# EAGLE design m1k-minus-5-generator (EAGLE 7.7.0)
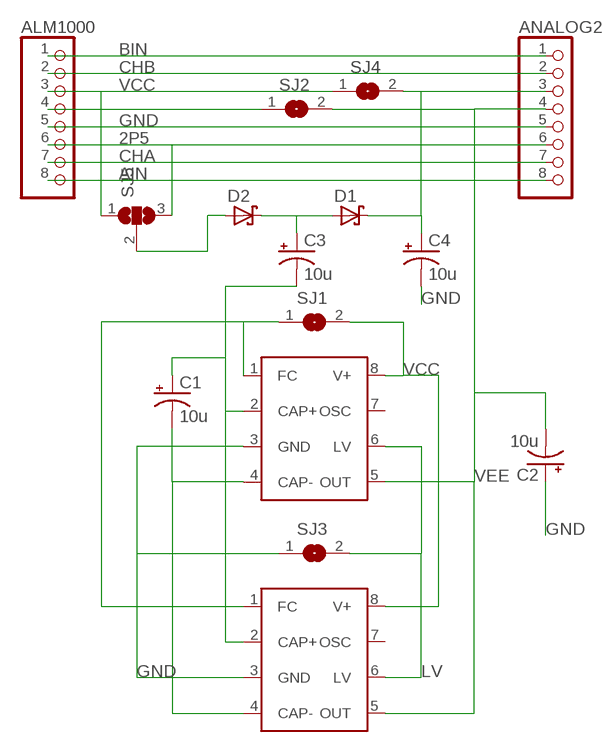
[diagram p0: schematic, sheet 1]

## Parts
ALM1000  PINHD-1X8  [1X08]
ANALOG2  PINHD-1X8  [1X08]
C1  10u  CPOL-USE2,5-6E  [E2,5-6E]
C2  10u  CPOL-USE2,5-6E  [E2,5-6E]
C3  10u  CPOL-USE2,5-6E  [E2,5-6E]
C4  10u  CPOL-USE2,5-6E  [E2,5-6E]
D1  SCHOTTKY-DIODEDO35-7  [DO35-7]
D2  SCHOTTKY-DIODEDO35-7  [DO35-7]
SJ1  SJ  [SJ]
SJ2  SJ  [SJ]
SJ3  SJ  [SJ]
SJ4  SJ  [SJ]
SJ5  SJ2W  [SJ_2]
U1  ADM660  [SO8]
U2  ADM660DIP  [DIL8]

## Nets
2P5: ALM1000.6 ANALOG2.6 SJ5.3
AIN: ALM1000.8 ANALOG2.8
BIN: ALM1000.1 ANALOG2.1
CHA: ALM1000.7 ANALOG2.7
CHB: ALM1000.2 ANALOG2.2
GND: ALM1000.5 ANALOG2.5 C2.+ C4.- SJ3.1 U1.3(GND) U2.3(GND)
LV: SJ3.2 U1.6(LV) U2.6(LV)
N$1: ALM1000.4 SJ2.1
N$2: ANALOG2.3 C4.+ D1.C SJ4.2
N$3: C3.+ D1.A D2.C
N$4: D2.A SJ5.2
N$7: C1.+ C3.- U1.2(CAP+) U2.2(CAP+)
N$10: C1.- U1.4(CAP-) U2.4(CAP-)
N$11: SJ1.1 U1.1(FC) U2.1(FC)
VCC: ALM1000.3 SJ1.2 SJ4.1 SJ5.1 U1.8(V+) U2.8(V+)
VEE: ANALOG2.4 C2.- SJ2.2 U1.5(OUT) U2.5(OUT)
Unconnected: U1.7(OSC) U2.7(OSC)

## Library data of the parts
ALM1000 ANALOG2 = pinhead:PINHD-1X8: PIN HEADER
C1-C4 = rcl:CPOL-US: POLARIZED CAPACITOR, American symbol
D1 D2 = diode:SCHOTTKY-DIODE: Schottky Diode
SJ1-SJ4 = jumper:SJ: SMD solder JUMPER
SJ5 = jumper:SJ2W: SMD solder JUMPER
U1 U2 = analog-devices:ADM660

## Board
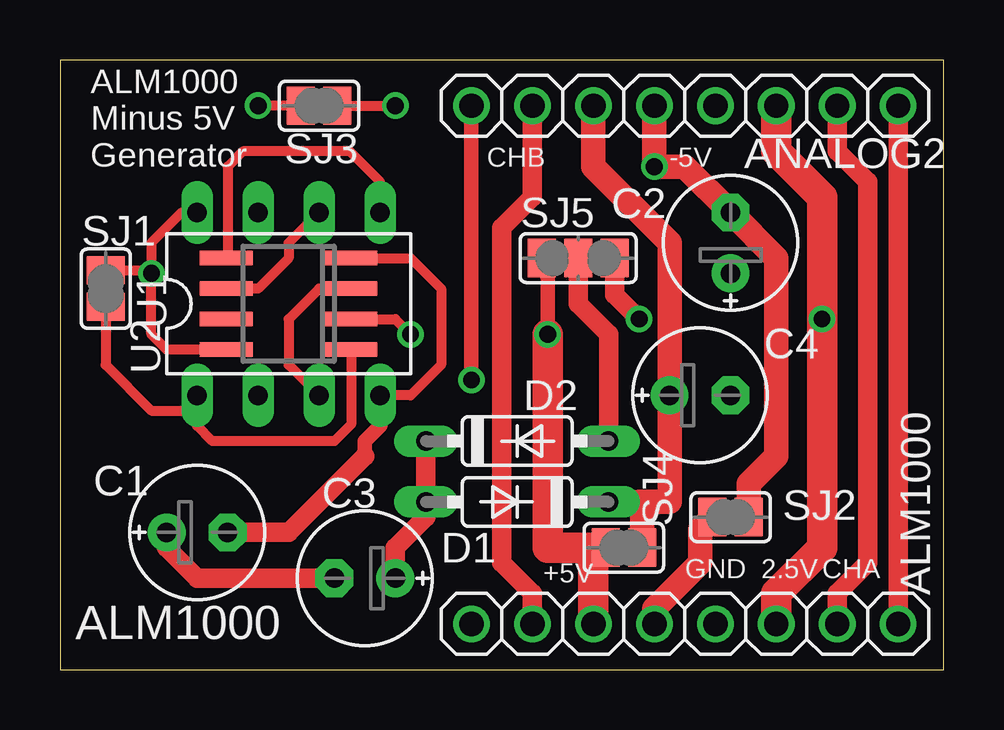
[diagram p1: board, top side]
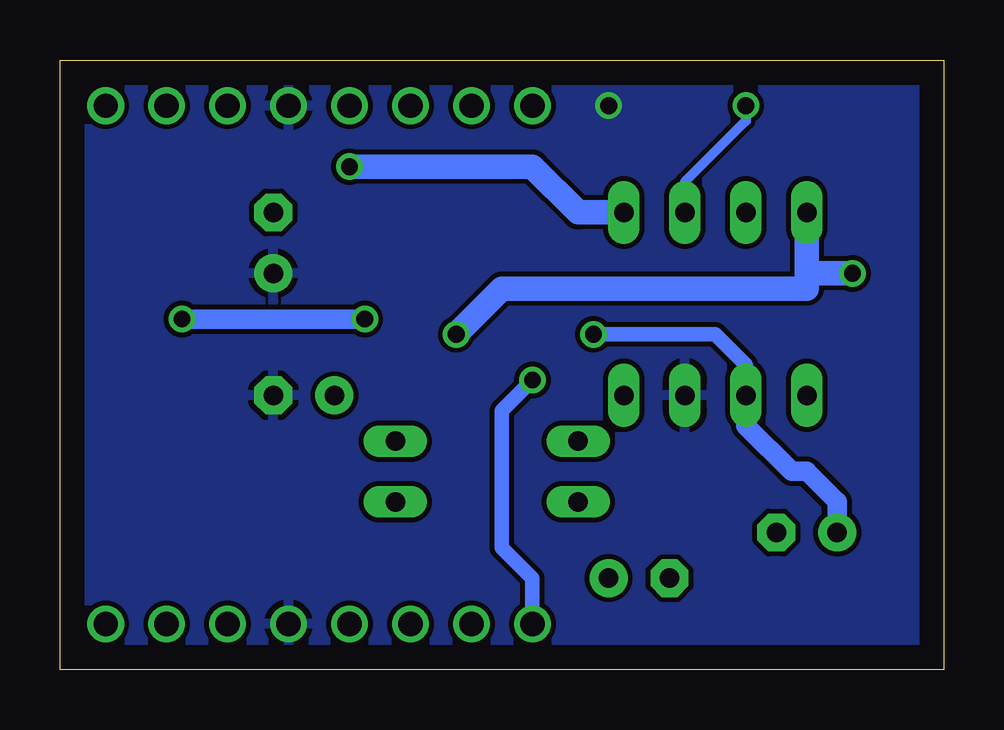
[diagram p2: board, bottom side, seen from below]

Size 36.83 x 25.4 mm. Coordinates in mm from the lower left corner, seen from the top.
Outline: 0,0 36.83,0 36.83,25.4 0,25.39 0,0
Copper layers (1*16): Top 0.035mm / dielectric 1.5mm / Bottom 0.035mm
Design rules "default": minimum track width 10mil, minimum drill 24mil, track to track 8mil, track to pad 8mil, pad to pad 8mil, via to via 8mil, smd to smd 8mil, copper to edge 40mil, drill to drill 8mil, minimum pad ring 10mil, minimum via ring 8mil, stop-mask expansion 4mil, vias tented up to drill 0mil, thermal gap 10mil

### Footprints (pad centres in the part's own frame; a part is rotated, then mirrored left to right if it is on the bottom)
1X08 = drill 1.016: 1 -8.89,0; 2 -6.35,0; 3 -3.81,0; 4 -1.27,0; 5 1.27,0; 6 3.81,0; 7 6.35,0; 8 8.89,0
E2,5-6E = drill 0.813 pad 1.575: + -1.27,0 | drill 0.813 pad 1.575 octagon: - 1.27,0
DO35-7 = drill 0.813 long: A 3.81,0; C -3.81,0
SJ = smd 1.168 x 1.6: 1 -0.762,0; 2 0.762,0
SJ_2 = smd 1.168 x 1.6: 1 -1.524,0; 2 0,0; 3 1.524,0
SO8 = smd 0.6 x 2.2: 1 -1.905,-2.6; 2 -0.635,-2.6; 3 0.635,-2.6; 4 1.905,-2.6; 5 1.905,2.6; 6 0.635,2.6; 7 -0.635,2.6; 8 -1.905,2.6
DIL8 = drill 0.813 long: 1 -7.62,-2.54; 2 -5.08,-2.54; 3 -2.54,-2.54; 4 0,-2.54; 5 0,5.08; 6 -2.54,5.08; 7 -5.08,5.08; 8 -7.62,5.08

### Placement (x,y rotation side)
ALM1000  26.04,1.91 0 top
ANALOG2  26.04,23.5 0 top
C1  5.71,5.71 0 top
C2  27.94,17.78 90 top
C3  12.7,3.81 180 top
C4  26.67,11.43 0 top
D1  19.05,6.99 180 top
D2  19.05,9.53 0 top
SJ1  1.91,15.88 90 top
SJ2  27.94,6.35 0 top
SJ3  10.79,23.5 180 top
SJ4  23.5,5.08 0 top
SJ5  21.59,17.14 0 top
U1  9.53,15.24 90 top
U2  13.34,13.97 0 top

### Tracks (layer width: path | path; a pad name or v marks a point on that pad's centre or on a via)
2P5  (via drill 0.7)
  Top 0.813: SJ5.3 23.11,15.62 v24.13,14.61
  Top 1.27: ALM1000.6 29.84,3.17 31.75,5.08 v31.75,14.61 31.75,19.68 29.84,21.59 ANALOG2.6
  Bottom 0.813: v31.75,14.61 v24.13,14.61
AIN
  Top 0.813: ALM1000.8 ANALOG2.8
BIN  (via drill 0.7)
  Top 0.61: v17.14,12.06 ANALOG2.1
  Bottom 0.61: ALM1000.1 17.14,3.81 18.41,5.08 18.41,10.79 v17.14,12.06
CHA
  Top 0.813: ALM1000.7 32.38,3.17 33.66,4.45 33.66,20.32 32.38,21.59 ANALOG2.7
CHB
  Top 0.813: ALM1000.2 19.68,3.17 18.41,4.45 18.41,18.41 19.68,19.68 ANALOG2.2
GND  (via drill 0.7)
  Top 0.406: U1.3 10.79,15.88 9.53,14.61 9.53,12.7 U2.3 | SJ3.1 v13.97,23.5
  pour Bottom: 0,0.64 36.83,0.64 36.83,24.77 0,24.77
LV  (via drill 0.7)
  Top 0.406: SJ3.2 v8.26,23.5 | U2.6 9.53,17.78 9.53,17.14 8.26,15.88 U1.6
  Bottom 0.406: v8.26,23.5 8.26,22.86 10.79,20.32 U2.6
N$1
  Top 1.016: ALM1000.4 24.77,2.54 26.67,4.45 26.67,5.84 SJ2.1
N$2
  Top 0.813: 24.13,6.99 D1.C
  Top 1.016: ANALOG2.3 22.23,20.95 25.4,17.78 C4.+ 25.4,6.99 24.13,6.99 24.26,6.86 SJ4.2
N$3
  Top 0.813: D2.C D1.A 15.24,6.35 13.97,5.08 C3.+
N$4
  Top 0.813: D2.A 22.86,13.97 21.59,15.24 SJ5.2
N$7  (via drill 0.7)
  Top 0.406: U1.2 13.97,14.61 v14.61,13.97
  Top 0.813: C3.- 5.71,3.81 4.45,5.08 C1.+
  Bottom 0.61: U2.2 8.26,12.7 9.53,13.97 v14.61,13.97
  Bottom 0.813: C1.+ 4.45,6.99 5.71,8.26 6.35,8.26 8.26,10.16 U2.2
N$10
  Top 0.406: U1.4 14.61,17.14 15.88,15.88 15.88,12.7 14.61,11.43 U2.4
  Top 0.61: U2.4 13.34,10.16 12.7,9.53 12.7,8.89
  Top 0.813: 12.7,8.89 9.53,5.71 C1.-
N$11
  Top 0.406: U1.1 12.12,10.22 11.43,9.53 6.35,9.53 5.71,10.16 5.71,10.79 | 5.71,10.79 U2.1 | SJ1.1 1.91,12.7 3.81,10.79 5.71,10.79
VCC  (via drill 0.7)
  Top 0.406: U1.8 4.45,13.34 3.81,13.97 v3.81,16.51 | U2.8 5.08,19.05 3.81,17.78 v3.81,16.51 | SJ1.2 3.68,16.64 v3.81,16.51
  Top 0.61: v20.32,13.97 20.32,16.26 SJ5.1
  Top 1.016: SJ4.1 22.23,5.08
  Top 1.27: v20.32,13.97 20.32,5.08 22.23,5.08 ALM1000.3
  Bottom 1.016: v3.81,16.51 5.71,16.51 | v20.32,13.97 18.41,15.88 5.71,15.88 5.71,16.51 | U2.8 5.71,16.51
VEE  (via drill 0.7)
  Top 0.406: U2.5 13.34,20.32 12.06,21.59 7.62,21.59 6.99,20.95 6.99,17.2 U1.5
  Top 1.016: ANALOG2.4 v24.77,20.95 26.04,20.95 C2.- 29.84,17.14 29.84,8.89 28.7,7.75 SJ2.2
  Bottom 1.016: U2.5 15.24,19.05 17.14,20.95 v24.77,20.95

### Text on the board
tPlace: ALM1000 / Minus 5V / Generator | CHB | -5V | +5V | GND | 2.5V | CHA | ALM1000